# EAGLE design deska (EAGLE 7.3.0)
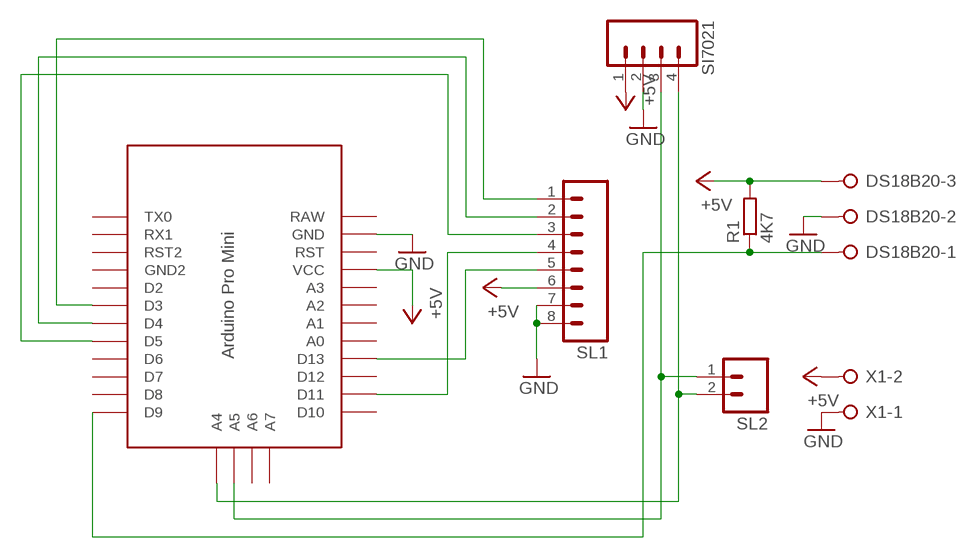
[diagram p0: schematic, sheet 1]

## Parts
DS18B20  W237-03P  [W237-133]
R1  4K7  R-EU_0207/10  [0207/10]
SI7021  M04  [04P]
SL1  M08  [08P]
SL2  M02  [02P]
U$1  PRO-MINI  [PRO-MINI]
X1  W237-02P  [W237-132]

## Nets
+5V: DS18B20.3 R1.2 SI7021.1 SL1.6 U$1.VCC X1.2
CE: SL1.2 U$1.D4
CLK: SL1.5 U$1.D13
DC: SL1.3 U$1.D5
DIN: SL1.4 U$1.D11
GND: DS18B20.2 SI7021.2 SL1.7 SL1.8 U$1.GND X1.1
N$8: DS18B20.1 R1.1 U$1.D9
RESET: SL1.1 U$1.D3
SCL: SI7021.3 SL2.1 U$1.A5
SDA: SI7021.4 SL2.2 U$1.A4
Unconnected: U$1.A0 U$1.A1 U$1.A2 U$1.A3 U$1.A6 U$1.A7 U$1.D2 U$1.D6 U$1.D7 U$1.D8 U$1.D10 U$1.D12 U$1.GND1(GND2) U$1.RST U$1.RST1(RST2) U$1.RX1 U$1.TX0

## Power pins joined to a net without a drawn wire
RAW: U$1.RAW

## Library data of the parts
DS18B20 = con-wago-508:W237-03P: WAGO SREW CLAMP; OC_FARNELL: unknown; OC_NEWARK: unknown
R1 = rcl:R-EU_: RESISTOR, European symbol
SI7021 = con-amp-quick:M04: AMP QUICK CONNECTOR; OC_FARNELL: unknown; OC_NEWARK: unknown
SL1 = con-amp-quick:M08: AMP QUICK CONNECTOR; OC_FARNELL: unknown; OC_NEWARK: unknown
SL2 = con-amp-quick:M02: AMP QUICK CONNECTOR; OC_FARNELL: unknown; OC_NEWARK: unknown
U$1 = Arduino-clone:PRO-MINI: Arduion Pro Mini Clone V1.0 www.betemcu.cu
X1 = con-wago-508:W237-02P: WAGO SREW CLAMP; OC_FARNELL: unknown; OC_NEWARK: unknown

## Board
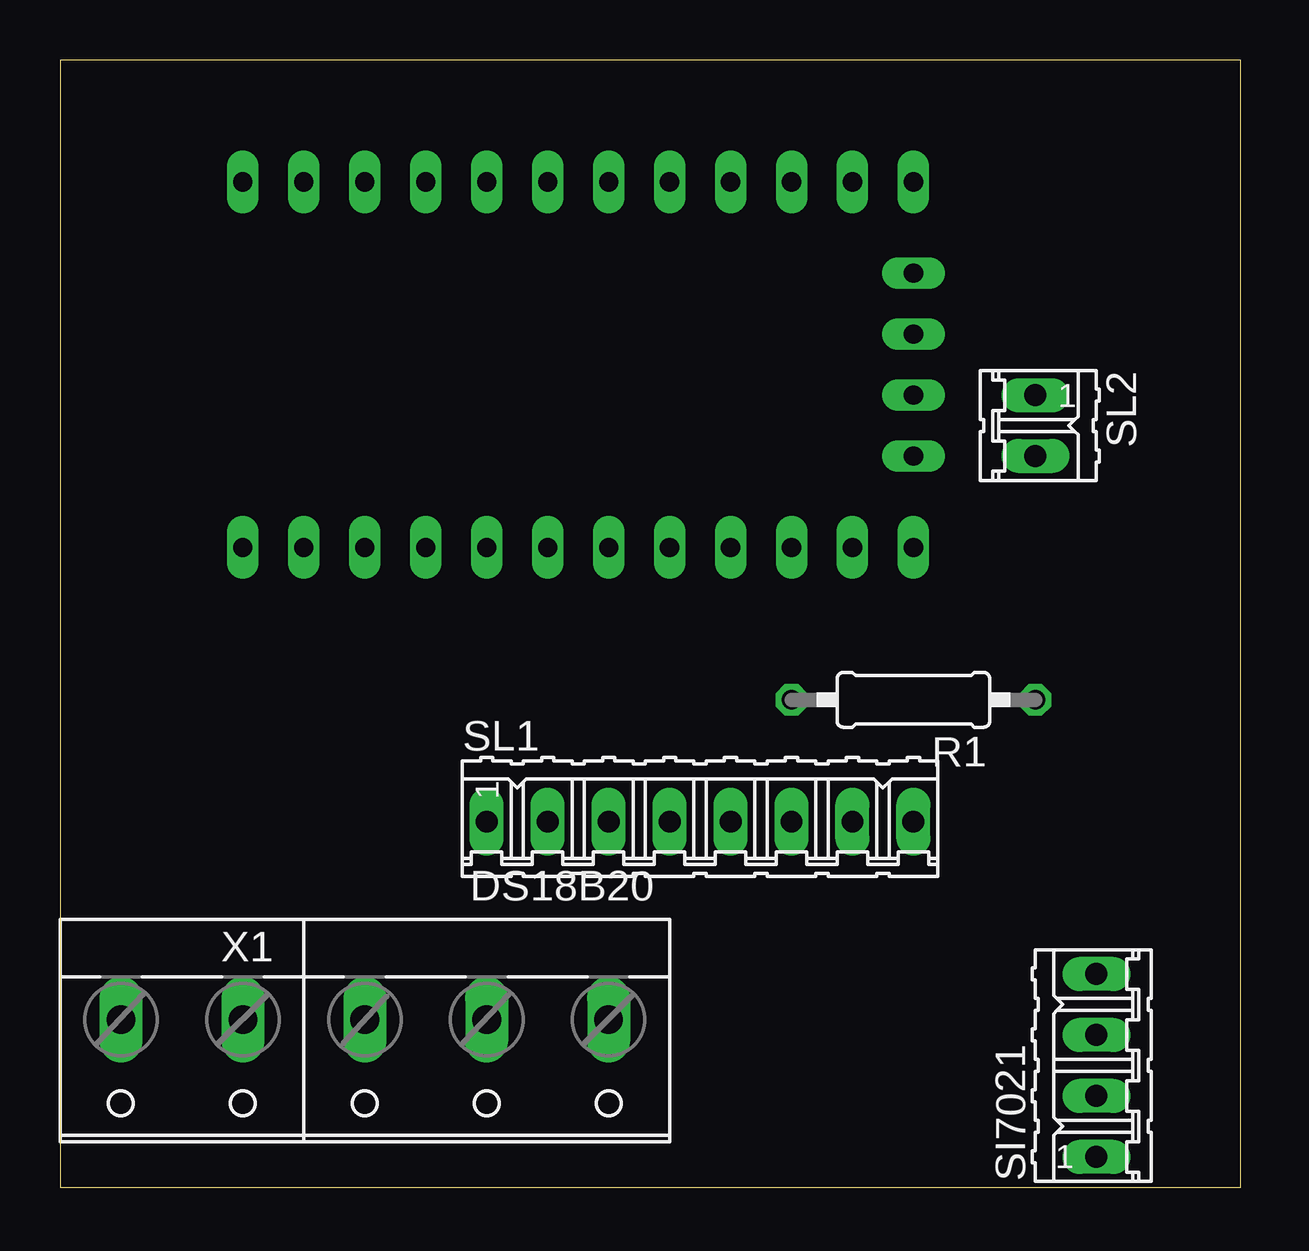
[diagram p1: board, top side]
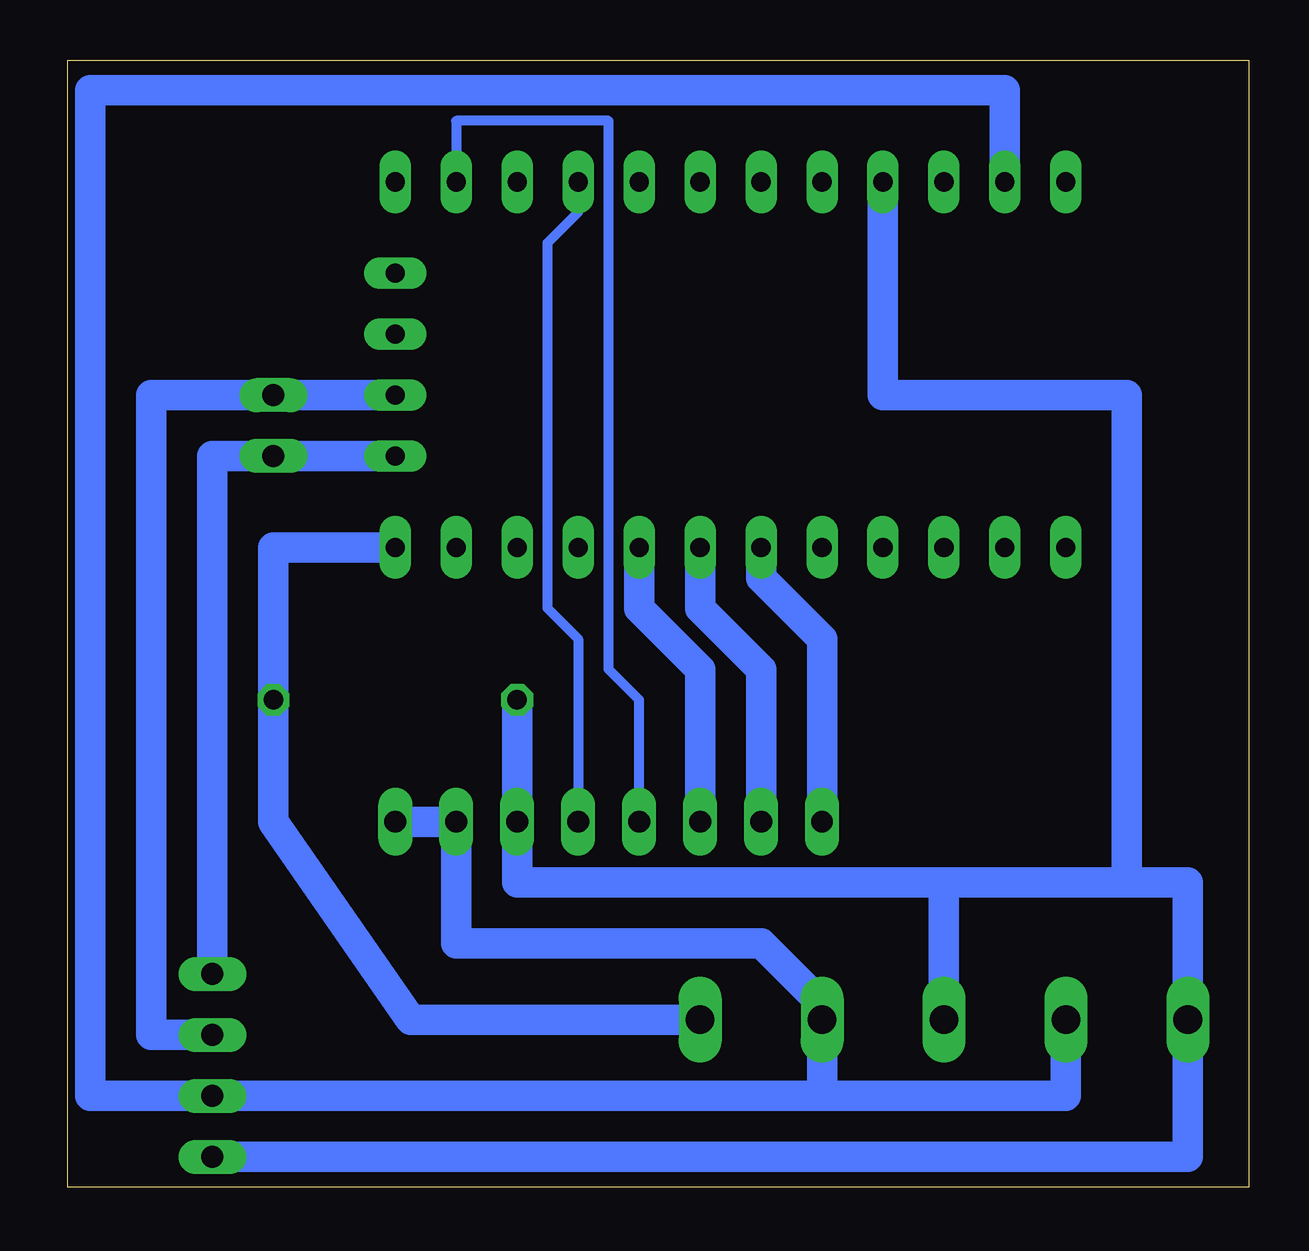
[diagram p2: board, bottom side, seen from below]

Size 49.2 x 46.98 mm. Coordinates in mm from the lower left corner, seen from the top.
Outline: 0,0 49.2,0 49.2,46.98 0,46.98 0,0
Copper layers (1*16): Top 0.035mm / dielectric 1.5mm / Bottom 0.035mm
Design rules "default": minimum track width 10mil, minimum drill 24mil, track to track 8mil, track to pad 8mil, pad to pad 8mil, via to via 8mil, smd to smd 8mil, copper to edge 40mil, drill to drill 8mil, minimum pad ring 10mil, minimum via ring 8mil, stop-mask expansion 4mil, vias tented up to drill 0mil, thermal gap 10mil

### Footprints (pad centres in the part's own frame; a part is rotated, then mirrored left to right if it is on the bottom)
W237-133 = drill 1.194 long: 1 -5.08,-0.635; 2 0,-0.635; 3 5.08,-0.635
0207/10 = drill 0.813 octagon: 1 -5.08,0; 2 5.08,0
04P = drill 0.914 long: 1 -3.81,0; 2 -1.27,0; 3 1.27,0; 4 3.81,0
08P = drill 0.914 long: 1 -8.89,0; 2 -6.35,0; 3 -3.81,0; 4 -1.27,0; 5 1.27,0; 6 3.81,0; 7 6.35,0; 8 8.89,0
02P = drill 0.914 long: 1 -1.27,0; 2 1.27,0
PRO-MINI = drill 0.8 long: A0 8.89,8.89; A1 8.89,11.43; A2 8.89,13.97; A3 8.89,16.51; A4 -2.54,-1.27; A5 0,-1.27; A6 2.54,-1.27; A7 5.08,-1.27; D2 -6.35,16.51; D3 -6.35,13.97; D4 -6.35,11.43; D5 -6.35,8.89; D6 -6.35,6.35; D7 -6.35,3.81; D8 -6.35,1.27; D9 -6.35,-1.27; D10 8.89,-1.27; D11 8.89,1.27; D12 8.89,3.81; D13 8.89,6.35; GND 8.89,24.13; GND1 -6.35,19.05; RAW 8.89,26.67; RST 8.89,21.59; RST1 -6.35,21.59; RX1 -6.35,24.13; TX0 -6.35,26.67; VCC 8.89,19.05
W237-132 = drill 1.194 long: 1 -2.54,-0.635; 2 2.54,-0.635

### Placement (x,y rotation side)
DS18B20  17.78,6.35 180 top
R1  35.56,20.32 180 top
SI7021  43.18,5.08 90 top
SL1  26.67,15.24 0 top
SL2  40.64,31.75 270 top
U$1  34.29,33.02 90 top
X1  5.08,6.35 180 top

### Tracks (layer width: path | path; a pad name or v marks a point on that pad's centre or on a via)
+5V
  Bottom 1.27: 5.08,12.7 5.08,33.02 15.24,33.02 U$1.VCC | DS18B20.3 12.7,12.7 | 12.7,12.7 5.08,12.7 | 5.08,12.7 2.54,12.7 X1.2 2.54,1.27 SI7021.1 | R1.2 SL1.6 30.48,12.7 12.7,12.7
CE
  Bottom 1.27: SL1.2 20.32,21.59 22.86,24.13 U$1.D4
CLK
  Bottom 0.406: U$1.D13 27.94,40.64 29.21,39.37 29.21,24.13 27.94,22.86 SL1.5
DC
  Bottom 1.27: SL1.3 22.86,21.59 25.4,24.13 U$1.D5
DIN
  Bottom 0.406: U$1.D11 33.02,44.45 26.67,44.45 26.67,21.59 25.4,20.32 SL1.4
GND
  Bottom 1.27: X1.1 7.62,3.81 17.78,3.81 | U$1.GND 10.16,45.72 48.26,45.72 48.26,3.81 SI7021.2 17.78,3.81 | 17.78,3.81 DS18B20.2 17.78,7.62 20.32,10.16 33.02,10.16 SL1.7 SL1.8
N$8
  Bottom 1.27: U$1.D9 40.64,26.67 R1.1 40.64,15.24 34.92,6.99 DS18B20.1
RESET
  Bottom 1.27: SL1.1 17.78,22.86 20.32,25.4 U$1.D3
SCL
  Bottom 1.27: SI7021.3 45.72,6.35 45.72,33.02 SL2.1 U$1.A5
SDA
  Bottom 1.27: U$1.A4 SL2.2 43.18,30.48 SI7021.4